# Altium schematic sheet FilterControl.Schematic.SchDoc
size A
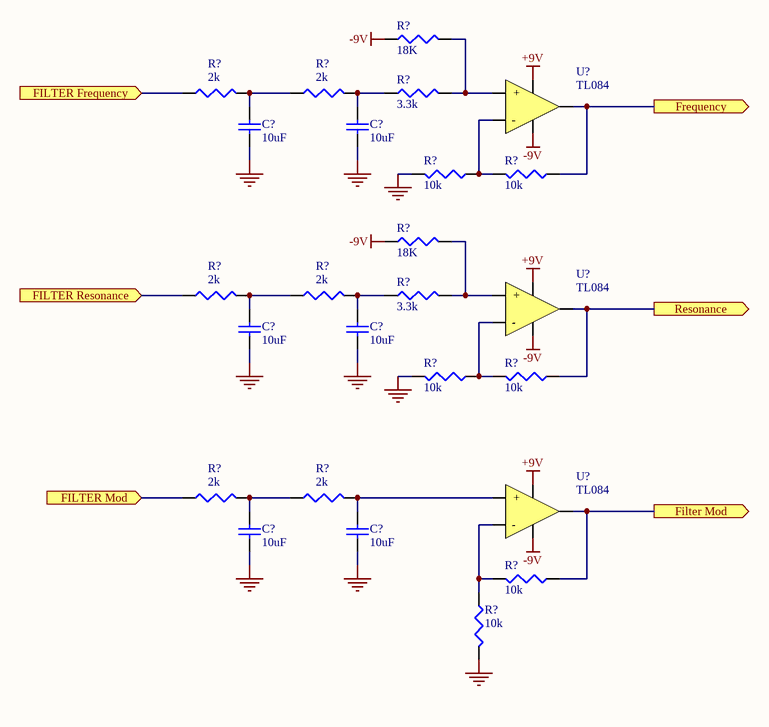
[diagram p0: FilterControl.Schematic.SchDoc]

## Parts
(Parts that share a designator on the sheet are numbered #1, #2 ... from top to bottom, then left to right.)
C?#1  10uF  [C1206]
C?#2  10uF  [C1206]
C?#3  10uF  [C1206]
C?#4  10uF  [C1206]
C?#5  10uF  [C1206]
C?#6  10uF  [C1206]
R?#1  18K  [J1-0603]
R?#2  2k  [J1-0603]
R?#3  2k  [J1-0603]
R?#4  3.3k  [J1-0603]
R?#5  10k  [J1-0603]
R?#6  10k  [J1-0603]
R?#7  18K  [J1-0603]
R?#8  2k  [J1-0603]
R?#9  2k  [J1-0603]
R?#10  3.3k  [J1-0603]
R?#11  10k  [J1-0603]
R?#12  10k  [J1-0603]
R?#13  2k  [J1-0603]
R?#14  2k  [J1-0603]
R?#15  10k  [J1-0603]
R?#16  10k  [J1-0603]
U?#1  TL084
U?#2  TL084
U?#3  TL084

## Ports
FILTER Frequency (in), FILTER Mod (in), Filter Mod (out), FILTER Resonance (in), Frequency (out), Resonance (out)

## Nets
+9V: U?#1.4(VCC+) U?#2.4(VCC+) U?#3.4(VCC+)
-9V: R?#1.1 R?#7.1 U?#1.11(VCC-) U?#2.11(VCC-) U?#3.11(VCC-)
GND: C?#1.1 C?#2.1 C?#3.1 C?#4.1 C?#5.1 C?#6.1 R?#5.2 R?#11.2 R?#16.2
FILTER Frequency: R?#2.1 ; port FILTER Frequency
Filter Mod: R?#13.1 R?#15.1 U?#3.1(OUT) ; port Filter Mod, port FILTER Mod
FILTER Resonance: R?#8.1 ; port FILTER Resonance
Frequency: R?#6.1 U?#1.1(OUT) ; port Frequency
Resonance: R?#12.1 U?#2.1(OUT) ; port Resonance
NetC?#1_2: C?#1.2 R?#2.2 R?#3.1
NetC?#2_2: C?#2.2 R?#3.2 R?#4.1
NetC?#3_2: C?#3.2 R?#8.2 R?#9.1
NetC?#4_2: C?#4.2 R?#9.2 R?#10.1
NetC?#5_2: C?#5.2 R?#13.2 R?#14.1
NetC?#6_2: C?#6.2 R?#14.2 U?#3.2(+)
NetR?#1_2: R?#1.2 R?#4.2 U?#1.2(+)
NetR?#5_1: R?#5.1 R?#6.2 U?#1.3(-)
NetR?#7_2: R?#7.2 R?#10.2 U?#2.2(+)
NetR?#11_1: R?#11.1 R?#12.2 U?#2.3(-)
NetR?#15_2: R?#15.2 R?#16.1 U?#3.3(-)

## Library data of the parts
C?#1-C?#6 = Cap Semi: Capacitor (Semiconductor SIM Model); Value: 10u; Published: 8-Jun-2000; LatestRevisionDate: 29-May-2009; LatestRevisionNote: IPC-7351 Footprint Added.; PackageReference: C1206; Publisher: Altium Limited; PackageDescription: Chip Capacitor
R?#1-R?#16 = Res3: Resistor; Published: 8-Jun-2000; LatestRevisionDate: 29-May-2009; LatestRevisionNote: IPC-7351 Footprint Added.; PackageReference: J1-0603; Publisher: Altium Limited; PackageDescription: Chip Resistor
  R?#1 R?#7: Value: 18K
  R?#2 R?#3 R?#8 R?#9 R?#13 R?#14: Value: 2K
  R?#4 R?#10: Value: 3.3K
  R?#5 R?#6 R?#11 R?#12 R?#15 R?#16: Value: 10K